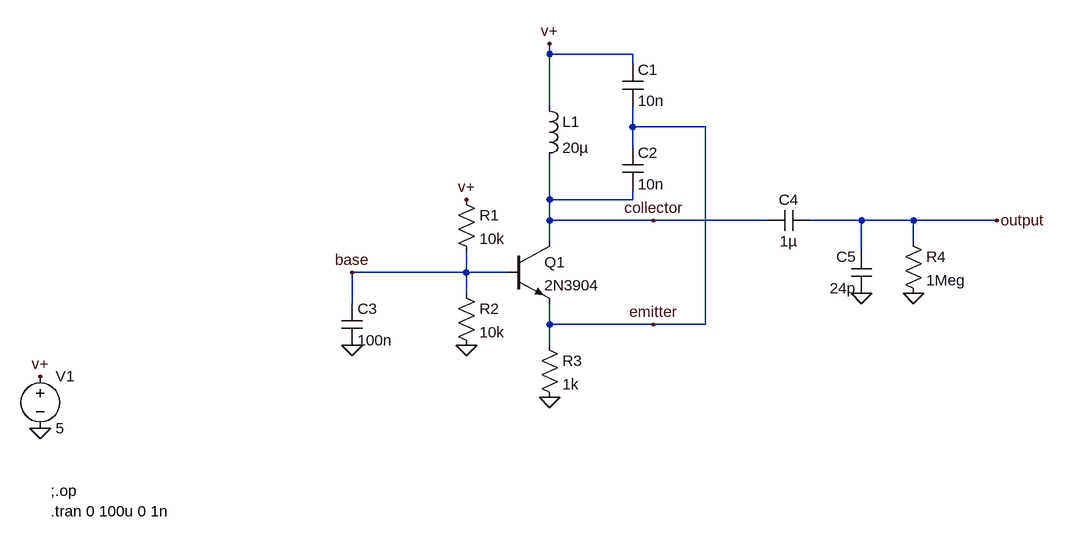
[diagram p0: schematic task2.asc]
task2.asc, the LTspice schematic file:
Version 4
SHEET 1 1584 680
WIRE 800 -336 800 -352
WIRE 928 -336 800 -336
WIRE 928 -320 928 -336
WIRE 800 -256 800 -336
WIRE 928 -224 928 -256
WIRE 1040 -224 928 -224
WIRE 928 -192 928 -224
WIRE 800 -112 800 -176
WIRE 928 -112 928 -128
WIRE 928 -112 800 -112
WIRE 800 -80 800 -112
WIRE 960 -80 800 -80
WIRE 1136 -80 960 -80
WIRE 1280 -80 1200 -80
WIRE 1360 -80 1280 -80
WIRE 1488 -80 1360 -80
WIRE 800 -48 800 -80
WIRE 1360 -48 1360 -80
WIRE 1280 -32 1280 -80
WIRE 672 0 672 -32
WIRE 672 0 496 0
WIRE 736 0 672 0
WIRE 672 32 672 0
WIRE 496 48 496 0
WIRE 800 80 800 48
WIRE 960 80 800 80
WIRE 1040 80 1040 -224
WIRE 1040 80 960 80
WIRE 800 112 800 80
FLAG 496 112 0
FLAG 672 112 0
FLAG 800 192 0
FLAG 16 240 0
FLAG 16 160 v+
FLAG 672 -112 v+
FLAG 800 -352 v+
FLAG 1280 32 0
FLAG 1360 32 0
FLAG 1488 -80 output
FLAG 496 0 base
FLAG 960 -80 collector
FLAG 960 80 emitter
SYMBOL voltage 16 144 R0
WINDOW 123 0 0 Left 0
WINDOW 39 0 0 Left 0
SYMATTR InstName V1
SYMATTR Value 5
SYMBOL npn 736 -48 R0
SYMATTR InstName Q1
SYMATTR Value 2N3904
SYMBOL ind 784 -272 R0
SYMATTR InstName L1
SYMATTR Value 20µ
SYMATTR SpiceLine Cpar=0
SYMBOL res 656 -128 R0
SYMATTR InstName R1
SYMATTR Value 10k
SYMBOL res 656 16 R0
SYMATTR InstName R2
SYMATTR Value 10k
SYMBOL res 784 96 R0
SYMATTR InstName R3
SYMATTR Value 1k
SYMBOL cap 912 -320 R0
SYMATTR InstName C1
SYMATTR Value 10n
SYMBOL cap 912 -192 R0
SYMATTR InstName C2
SYMATTR Value 10n
SYMBOL cap 480 48 R0
SYMATTR InstName C3
SYMATTR Value 100n
SYMBOL cap 1200 -96 R90
WINDOW 0 0 32 VBottom 2
WINDOW 3 32 32 VTop 2
SYMATTR InstName C4
SYMATTR Value 1µ
SYMBOL cap 1296 32 R180
WINDOW 0 24 56 Left 2
WINDOW 3 24 8 Left 2
SYMATTR InstName C5
SYMATTR Value 24p
SYMBOL res 1344 -64 R0
SYMATTR InstName R4
SYMATTR Value 1Meg
TEXT 32 336 Left 2 !;.op\n.tran 0 100u 0 1n

The netlist it stands for:
* task2.asc
V1 v+ 0 5
Q1 collector base emitter 0 2N3904
L1 v+ collector 20µ Cpar=0
R1 v+ base 10k
R2 base 0 10k
R3 emitter 0 1k
C1 v+ emitter 10n
C2 emitter collector 10n
C3 base 0 100n
C4 output collector 1µ
C5 0 output 24p
R4 output 0 1Meg
.model NPN NPN
.model PNP PNP
.lib standard.bjt
;.op
.tran 0 100u 0 1n
.backanno
.end

* Results of the author's LTspice run, read from the files saved beside the schematic
* Operating Point, zero values left out:
*   V(v+) = 5 V
*   V(collector) = 5 V
*   V(base) = 2.471 V
*   V(emitter) = 1.801 V
*   Ic(Q1) = 1.795 mA
*   Ib(Q1) = 5.861 µA
*   Ie(Q1) = -1.801 mA
*   I(L1) = 1.795 mA
*   I(R3) = 1.801 mA
*   I(R2) = 247.1 µA
*   I(R1) = 252.9 µA
*   I(V1) = -2.048 mA